# EAGLE schematic KoncovaCast_multi (EAGLE 6.4)
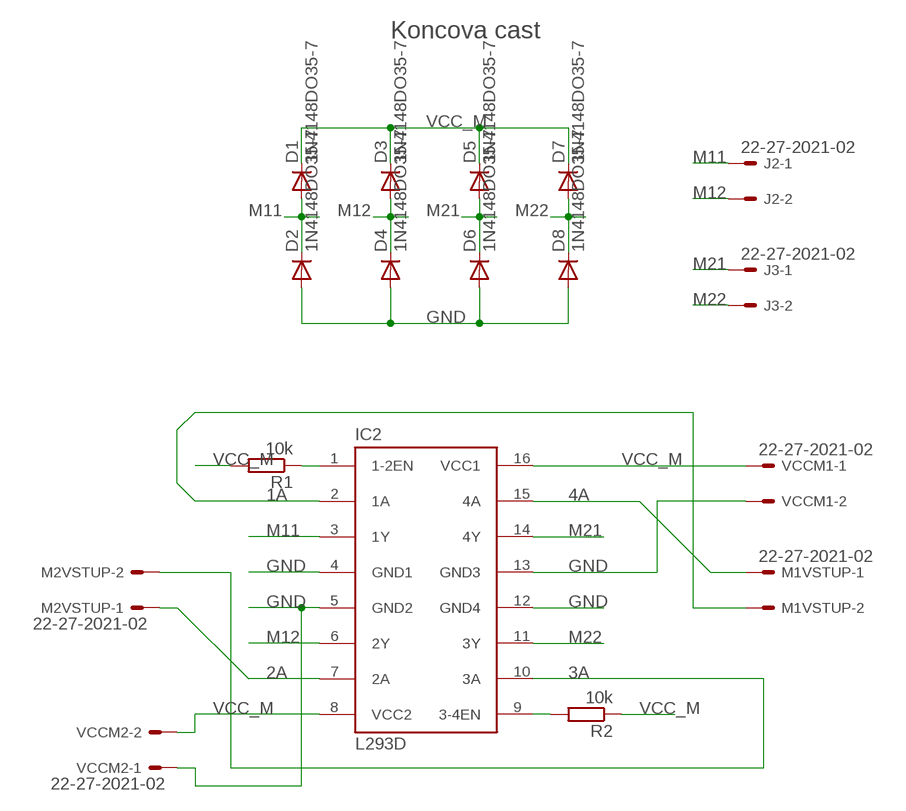
[diagram p0: schematic, sheet 1]

## Parts
D1  1N4148DO35-7  [DO35-7]
D2  1N4148DO35-7  [DO35-7]
D3  1N4148DO35-7  [DO35-7]
D4  1N4148DO35-7  [DO35-7]
D5  1N4148DO35-7  [DO35-7]
D6  1N4148DO35-7  [DO35-7]
D7  1N4148DO35-7  [DO35-7]
D8  1N4148DO35-7  [DO35-7]
IC2  L293D  [DIL16]
J2  22-27-2021-02  [6410-02]
J3  22-27-2021-02  [6410-02]
M1VSTUP  22-27-2021-02  [6410-02]
M2VSTUP  22-27-2021-02  [6410-02]
R1  10k  R-EU_0204/2V  [0204V]
R2  10k  R-EU_0204/2V  [0204V]
VCCM1  22-27-2021-02  [6410-02]
VCCM2  22-27-2021-02  [6410-02]

## Nets
1A: IC2.2(1A) M1VSTUP.2
2A: IC2.7(2A) M2VSTUP.1
3A: IC2.10(3A) M2VSTUP.2
4A: IC2.15(4A) M1VSTUP.1
GND: D2.A D4.A D6.A D8.A IC2.4(GND1) IC2.5(GND2) IC2.12(GND4) IC2.13(GND3) VCCM1.2 VCCM2.1
M11: D1.A D2.C IC2.3(1Y) J2.1
M12: D3.A D4.C IC2.6(2Y) J2.2
M21: D5.A D6.C IC2.14(4Y) J3.1
M22: D7.A D8.C IC2.11(3Y) J3.2
N$1: IC2.1(1-2EN) R1.1
N$2: IC2.9(3-4EN) R2.2
VCC_M: D1.C D3.C D5.C D7.C IC2.8(VCC2) IC2.16(VCC1) R1.2 R2.1 VCCM1.1 VCCM2.2

## Notes on the sheet
- Koncova cast

## Library data of the parts
D1-D8 = diode:1N4148: DIODE high speed (Philips)
IC2 = st-microelectronics:L293D: PUSH-PULL 4 CHANNEL DRIVER; MPN: L293D; OC_FARNELL: 9589619; OC_NEWARK: 56P8249
J2 J3 M1VSTUP M2VSTUP VCCM1 VCCM2 = con-molex:22-?-02: CONNECTOR wire to board 2.54 mm (.1 inch) pitch header; OC_FARNELL: unknown; OC_NEWARK: unknown
R1 R2 = resistor:R-EU_: RESISTOR, European symbol